# EasyEDA Pro project [Flatfish]_DevBoard.epro, board PCB
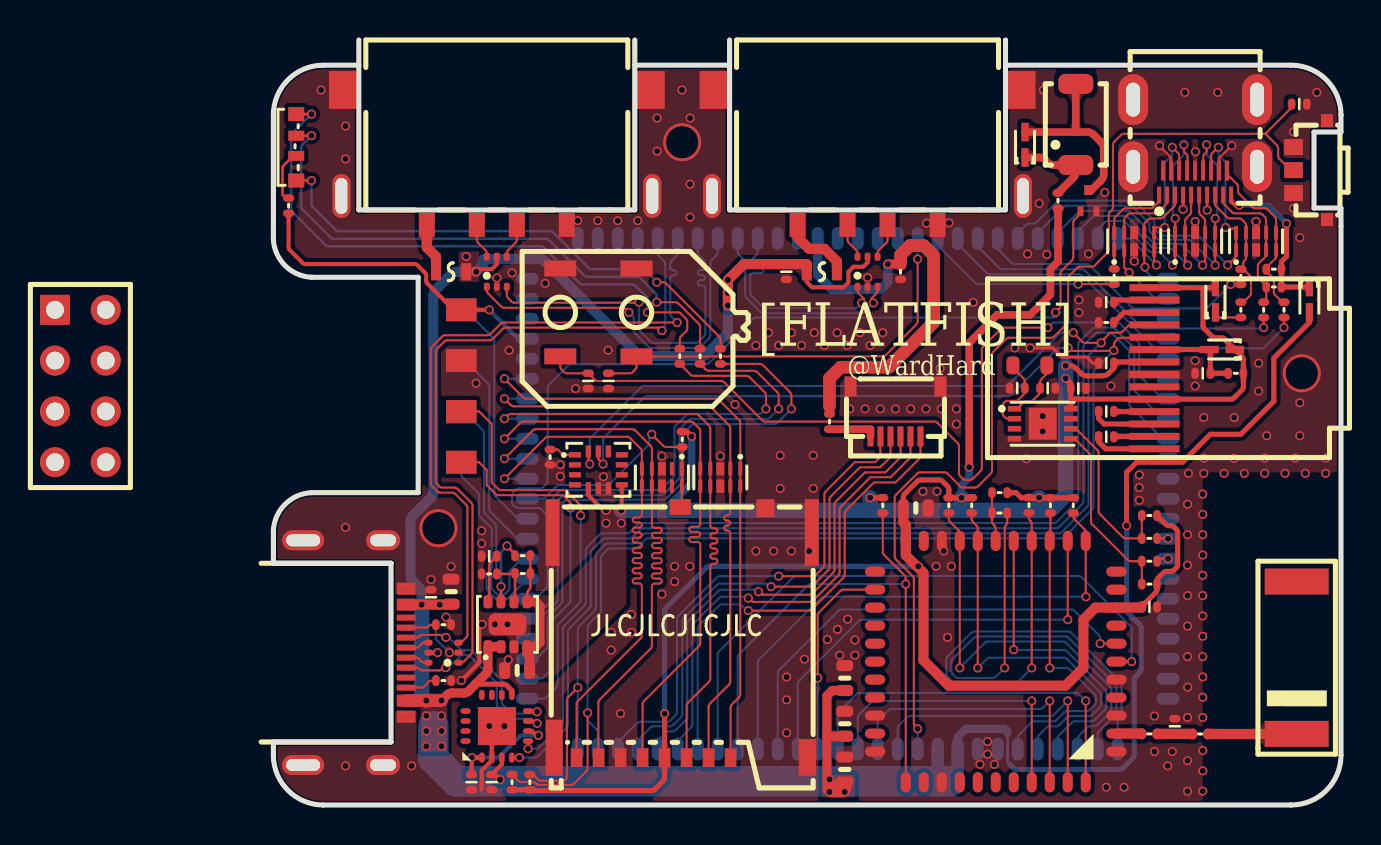
[diagram p1: board, top side]
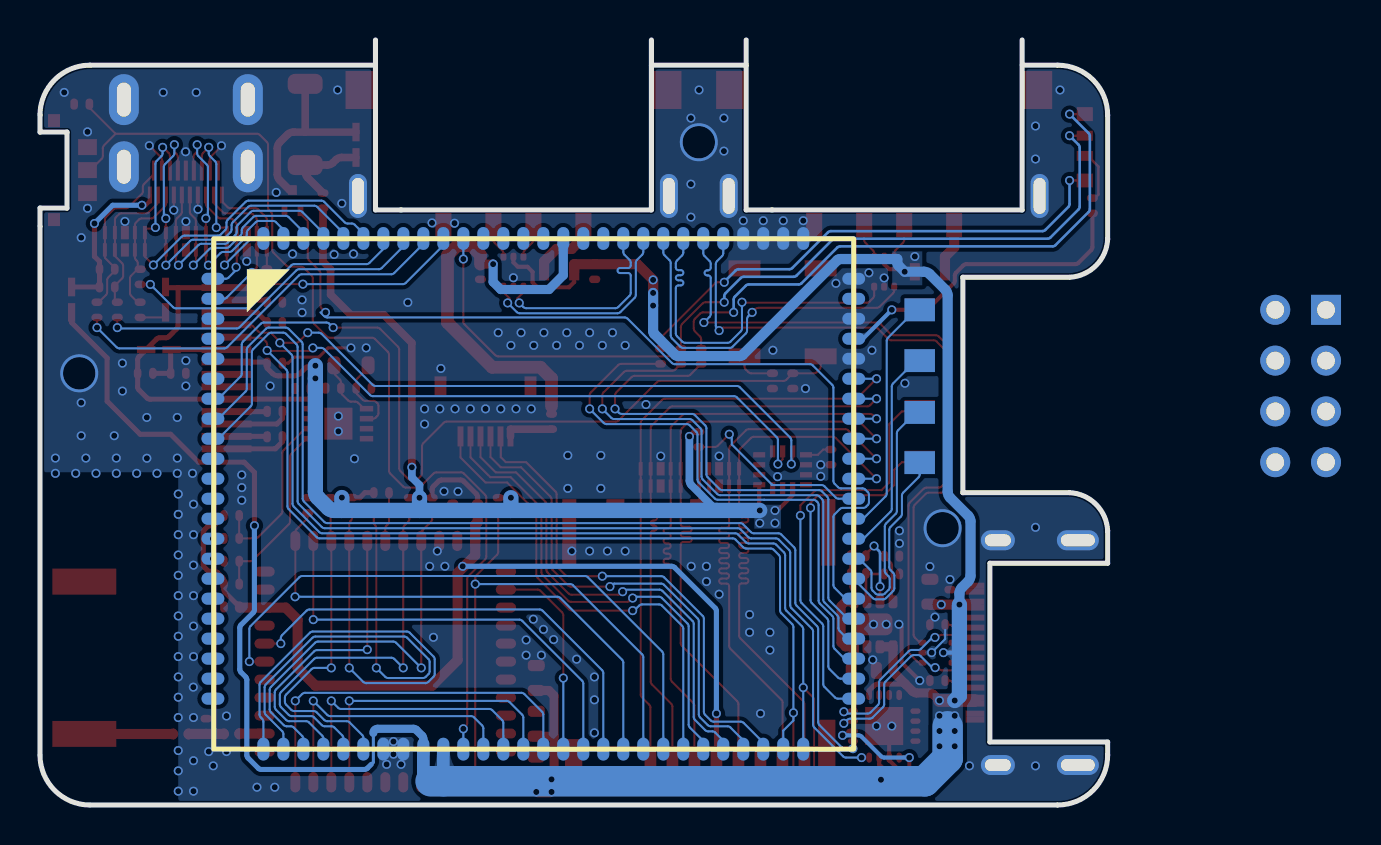
[diagram p2: board, bottom side, seen from below]

Outline 53.4 x 38.26 mm; copper layers: Top Layer, Bottom Layer. Coordinates in mm from the lower left corner of the outline.
Outline path: 4.27,37 2.5,37 arc(0.73,36.27) 0,34.5 0,28.3 arc(0.58,26.98) 1.91,26.39 7.24,26.39 7.24,15.62 1.91,15.62 arc(0.58,15.04) 0,13.72 0,12.09 5.89,12.09 5.89,3.15 0,3.15 0,2.5 arc(0.73,0.73) 2.5,0 50.9,0 arc(52.66,0.73) 53.4,2.5 53.4,28.94 ; 18.08,37 22.82,37 ; 36.62,37 50.9,37 arc(52.66,36.27) 53.4,34.5
Stack: Top Layer 0.035mm / Dielectric1 1.51mm FR4 er 4.5 / Bottom Layer 0.035mm

## Design rules (mm)
net USB0_DM: DP1
net USB0_DP: DP1
net USB1_DP: DP2
net USB1_DM: DP2
net USB2_DP: DP3
net USB2_DM: DP3
net UART0_DP: DP5
net UART0_DN: DP5
net USB3_DP: DP4
net USB3_DM: DP4
template: 自定义配置1
spacing copperThickness1oz (default): track to track 0.102, other pairs 0 to 0.3
spacing copperThickness2oz: track to track 0.203, other pairs 0.152 to 0.3
track width copperThickness1oz (default): min 0.102, default 0.102, max 2.54
track width copperThickness2oz: min 0.203, default 0.254, max 2.54
differential pair differentialPair (default): width min 0.102, default 0.203, max 2.54; gap min 0.152, default 0.152
via viaSize (default): diameter min 0.404, default 0.452, max 10; hole min 0.3, default 0.305, max 6.299

## Placement (name value [footprint] x y rotation side)
BUZZER2  DET402  [BUZ-SMD_L4.0-W3.0-LS4.5-FD]  40.13 34.04 90 top
C2  100nF  [C0603 NSK]  28.57 4.06 270 top
C33  10pF  [C0402-NSK]  38.73 20.85 180 top
C36  10pF  [C0402-NSK]  37.2 20.85 0 top
C43  22uF  [C0603 NSK]  12.19 6.73 0 top
C45  3.3nF  [C0402-NSK]  10.79 12.45 0 top
C46  1uF  [C0402-NSK]  41.66 18.42 180 top
C47  1uF  [C0402-NSK]  41.66 19.69 0 top
C48  2.2uF  [C0402-NSK]  41.66 25.15 180 top
C49  100nF  [C0402-NSK]  41.66 22.1 180 top
C76  22uF  [C0603 NSK]  8.89 10.67 270 top
C77  22uF  [C0603 NSK]  28.57 1.78 270 top
C78  100nF  [C0402-NSK]  7.89 10.39 90 top
C79  22uF  [C0603 NSK]  32.13 14.86 180 top
C80  100nF  [C0402-NSK]  43.81 9.91 0 top
C81  100nF  [C0402-NSK]  45.09 3.94 90 top
C83  22uF  [C0603 NSK]  28.57 6.35 270 top
C84  100nF  [C0402-NSK]  9.91 1.14 270 top
C85  100nF  [C0402-NSK]  10.92 1.14 270 top
C86  100nF  [C0402-NSK]  51.31 35.05 0 top
C87  100nF  [C0402-NSK]  15.75 21.21 270 top
C88  100nF  [C0402-NSK]  16.76 21.21 270 top
C89  100nF  [C0402-NSK]  40.26 20.83 180 top
C90  22uF  [C0402-NSK]  25.65 26.67 270 top
C91  2.2uF  [C0402-NSK]  46.48 21.59 0 top
CARD1  5033981892  [TF-SMD_503398-1892]  20.45 8.64 180 top
D3  ESD73034D  [DFN2510-10_L2.5-W1.0-P0.50-BL]  43.05 28.19 0 top
D4  ESD73034D  [DFN2510-10_L2.5-W1.0-P0.50-BL]  46.1 28.19 0 top
D5  USBLC6-2P6  [DFN2510-10_L2.5-W1.0-P0.50-BL]  49.15 28.19 0 top
D6  ESD73034D  [DFN2510-10_L2.5-W1.0-P0.50-BL]  22.35 16.38 180 top
D7  ESD73034D  [DFN2510-10_L2.5-W1.0-P0.50-BL]  19.43 16.38 180 top
D8  ESD73034D  [SOT-666-6_L1.6-W1.2-P0.50-LS1.6-BL]  29.72 26.67 0 top
D9  USBLC6-2P6  [SOT-666-6_L1.6-W1.2-P0.50-LS1.6-BL]  11.18 26.67 0 top
D10  USBLC6-2P6  [SOT-666-6_L1.6-W1.2-P0.50-LS1.6-BL]  8.51 7.62 90 top
F1  0603L035/16XR  [F0603]  27.43 26.67 0 top
F2  0603L035/16XR  [F0603]  8.89 26.67 180 top
H1  -  [圆形焊盘]  9.4 19.69 90 top
H2  B254YP-ZS04P  [圆形焊盘]  9.4 22.22 90 bottom
H3  -  [圆形焊盘]  9.4 24.77 90 bottom
H4  -  [圆形焊盘]  9.4 22.22 90 top
H5  -  [圆形焊盘]  9.4 24.77 90 top
H6  -  [圆形焊盘]  9.4 17.14 90 top
H7  -  [圆形焊盘]  9.4 17.12 270 bottom
H8  -  [圆形焊盘]  9.4 19.63 270 bottom
H9  圆形焊盘  [HDR-TH_8P-P2.54-V-F-R2-C5-S2.54_5-534206-4]  -9.65 20.95 270 top
LED1  XL-3806RGBC-4L  [LED-SMD_4P-L3.8-W1.0_XL-3806RGBC-4L]  1.14 32.89 270 top
OLED2  N050-8848TSWYG02-H14  [OLED-SMD_N050-8848TSWYG02-H14]  44.07 21.84 90 top
Q16  DTC143ZM  [SOT-723-3_L1.2-W0.8-P0.80-LS1.2-BR]  40.77 30.23 270 top
R1  100KΩ  [R0402]  20.45 18.29 90 top
R2  47KΩ  [R0402]  43.81 12.19 180 top
R3  150KΩ  [R0402]  43.81 13.33 180 top
R4  47KΩ  [R0402]  8.51 9.02 180 top
R5  47KΩ  [R0402]  8.51 6.22 0 top
R37  5.1kΩ  [R0402]  10.79 11.56 180 top
R38  0Ω  [R0402]  12.47 11.58 180 top
R39  0Ω  [R0402]  12.47 12.47 0 top
R54  20Ω  [R0402]  39.24 30.23 270 top
R55  1kΩ  [R0402]  42.05 26.43 270 top
R56  100Ω  [R0402]  49.53 24.77 270 top
R57  1.8kΩ  [R0402]  50.04 25.91 0 top
R58  100Ω  [R0402]  50.55 24.77 270 top
R59  1.8kΩ  [R0402]  50.04 26.8 0 top
R60  100Ω  [R0402]  48.39 26.42 270 top
R61  27kΩ  [R0402]  48.39 24.77 270 top
R62  5.1kΩ  [R0402]  43.81 11.05 180 top
R63  5.1kΩ  [R0402]  43.81 14.48 180 top
R64  0Ω  [R0402]  36.32 14.61 180 top
R65  0Ω  [R0402]  43.81 3.56 180 top
R66  0Ω  [R0402]  46.35 3.55 180 top
R67  560KΩ  [R0402]  41.66 24.13 0 top
R68  47KΩ  [R0402]  38.86 14.99 270 top
R69  47KΩ  [R0402]  37.79 15 270 top
R70  47KΩ  [R0402]  36.32 15.62 180 top
R71  47KΩ  [R0402]  34.93 14.99 270 top
R72  47KΩ  [R0402]  33.78 14.99 270 top
R73  10KΩ  [R0402]  40 14.99 270 top
R74  10KΩ  [R0402]  30.48 14.99 270 top
R75  0Ω  [R0402]  31.37 26.67 90 top
R76  2kΩ  [R0402]  0.76 29.97 270 top
R77  10kΩ  [R0402]  13.84 17.4 90 top
R78  5.1kΩ  [R0402]  12.83 1.14 90 top
R79  5.1kΩ  [R0402]  11.94 1.14 90 top
R80  0Ω  [R0402]  20.33 22.44 90 top
R81  0Ω  [R0402]  21.34 22.44 90 top
R82  0Ω  [R0402]  22.36 22.44 90 top
R83  0Ω  [R0402]  27.81 19.18 270 top
R84  2kΩ  [R0402]  48.13 21.59 0 top
SW1  EVPAEBB2A  [KEY-SMD_EVPAEBB2A]  51.86 31.75 90 top
SW2  SW_3*4*2MM  [SW-SMD_L3.9-W2.9-LS4.9-L]  14.35 24.64 270 top
SW3  SW_3*4*2MM  [SW-SMD_L3.9-W2.9-LS4.9-L]  18.16 24.64 270 top
U2  -  [AW869-A]  30.1 13.21 270 top
U3  OA-W01  [DS-H618-CORE]  12.45 28.58 0 bottom
U18  PCF85063  [VSON-8_L2.0-W3.0-P0.50-BL-EP]  38.47 19.07 270 top
U24  TPS82130SILR  [USIP-8_L3.0-W2.8-P0.65-TL-EP]  11.71 9.04 90 top
U32  1N5819WT  [SOD-523_L1.2-W0.8-LS1.6-RD]  37.59 33.02 90 top
U33  1N5819WT  [SOD-523_L1.2-W0.8-LS1.6-RD]  51.82 25.27 270 top
U34  1N5819WT  [SOD-523_L1.2-W0.8-LS1.6-RD]  47.12 25.27 90 top
U35  OA-W01  [ANT-SMD_L8.0-W3.0_A]  51.18 7.37 90 top
U37  -  [QFN-16_L3.0-W3.0-P0.50-TL-EP1.9]  11.18 3.94 90 top
U39  BMI270  [LGA-14_L3.0-W2.5-P0.50-BR]  16.26 16.76 180 top
U40  MTA-DT06-0050N-4/4/8/8  [FFC-SMD_6P-P0.50_FH34SRJ-6S-0.5SH]  31.12 19.69 180 top
U41  1N5819WT  [SOD-523_L1.2-W0.8-LS1.6-RD]  47.45 22.78 180 top
USB1  HX 8.5 CB1.9ZB  [MICRO-USB-SMD_HX-8.5-CB1.9ZB]  29.72 32.39 180 top
USB2  HX 8.5 CB1.9ZB  [MICRO-USB-SMD_HX-8.5-CB1.9ZB]  11.18 32.39 180 top
USB3  TYPE-C 16P CB1.6 073  [USB-C-SMD_SHOU_TYPE-C-16P-CB1.6]  4.06 7.62 270 top
USB5  HDMI-101S  [HDMI-SMD_HDMI-101S]  46.1 32.89 180 top
X1  32.768kHz  [OSC-SMD_L2.0-W1.2]  37.84 21.99 0 top

## Footprints (pads in the part's own frame, mm; a bottom-side part is the same pattern mirrored in y, then rotated)
ANT-SMD_L8.0-W3.0_A
  rect 1.3x3.2 smd: 1(-3.81,0) 2(3.81,0)
AW869-A
  oval 0.5x1.016 smd: 1(10.535,12.065) 2(9.635,12.065) 3(8.735,12.065) 4(7.835,12.065) 5(6.935,12.065) 6(6.035,12.065) 7(5.135,12.065) 8(4.235,12.065) 9(3.335,12.065) 10(2.435,12.065) 11(1.535,12.065) 23(1.535,-0.005) 24(2.435,-0.005) 25(3.335,-0.005) 26(4.235,-0.005) 27(5.135,-0.005) 28(6.035,-0.005) 29(6.935,-0.005) 30(7.835,-0.005) 31(8.735,-0.005) 32(9.635,-0.005) 33(10.535,-0.005)
  oval 1.016x0.5 smd: 12(0,10.53) 13(0,9.63) 14(0,8.73) 15(0,7.83) 16(0,6.93) 17(0,6.03) 18(0,5.13) 19(0,4.23) 20(0,3.33) 21(0,2.43) 22(0,1.53) 34(12.07,1.53) 35(12.07,2.43) 36(12.07,3.33) 37(12.07,4.23) 38(12.07,5.13) 39(12.07,6.03) 40(12.07,6.93) 41(12.07,7.83) 42(12.07,8.73) 43(12.07,9.63) 44(12.07,10.53)
BUZ-SMD_L4.0-W3.0-LS4.5-FD
  rrect 1x1.75 smd: 1(-2.03,0) 2(2.03,0)
C0402-NSK
  rrect 0.381x0.559 smd: 1(-0.381,0) 2(0.381,0)
C0603 NSK
  rrect 0.559x0.85 smd: 1(-0.623,0) 2(0.623,0)
DFN2510-10_L2.5-W1.0-P0.50-BL
  rect 0.2x0.665 smd: 1(-1,-0.433) 2(-0.5,-0.433) 4(0.5,-0.433) 5(1,-0.433) 6(1,0.433) 7(0.5,0.433) 9(-0.5,0.433) 10(-1,0.433)
  rect 0.4x0.665 smd: 3(0,-0.433) 8(0,0.433)
DS-H618-CORE
  oval 1.143x0.6 smd: 1(32.302,2.257) 2(32.302,3.257) 3(32.302,4.257) 4(32.302,5.257) 5(32.302,6.257) 6(32.302,7.257) 7(32.302,8.257) 8(32.302,9.257) 9(32.302,10.257) 10(32.302,11.257) 11(32.302,12.257) 12(32.302,13.257) 13(32.302,14.257) 14(32.302,15.257) 15(32.302,16.257) 16(32.302,17.257) 17(32.302,18.257) 18(32.302,19.257) 19(32.302,20.257) 20(32.302,21.257) 21(32.302,22.257) 22(32.302,23.257) 51(0.254,23.257) 52(0.254,22.257) 53(0.254,21.257) 54(0.254,20.257) 55(0.254,19.257) 56(0.254,18.257) 57(0.254,17.257) 58(0.254,16.257) 59(0.254,15.257) 60(0.254,14.257) 61(0.254,13.257) 62(0.254,12.257) 63(0.254,11.257) 64(0.254,10.257) 65(0.254,9.257) 66(0.254,8.257) 67(0.254,7.257) 68(0.254,6.257) 69(0.254,5.257) 70(0.254,4.257) 71(0.254,3.257) 72(0.254,2.257)
  oval 0.6x1.143 smd: 23(29.778,25.781) 24(28.778,25.781) 25(27.778,25.781) 26(26.778,25.781) 27(25.778,25.781) 28(24.778,25.781) 29(23.778,25.781) 30(22.778,25.781) 31(21.778,25.781) 32(20.778,25.781) 33(19.778,25.781) 34(18.778,25.781) 35(17.778,25.781) 36(16.778,25.781) 37(15.778,25.781) 38(14.778,25.781) 39(13.778,25.781) 40(12.778,25.781) 41(11.778,25.781) 42(10.778,25.781) 43(9.778,25.781) 44(8.778,25.781) 45(7.778,25.781) 46(6.778,25.781) 47(5.778,25.781) 48(4.778,25.781) 49(3.778,25.781) 50(2.778,25.781) 73(2.778,0.241) 74(3.778,0.241) 75(4.778,0.241) 76(5.778,0.241) 77(6.778,0.241) 78(7.778,0.241) 79(8.778,0.241) 80(9.778,0.241) 81(10.778,0.241) 82(11.778,0.241) 83(12.778,0.241) 84(13.778,0.241) 85(14.778,0.241) 86(15.778,0.241) 87(16.778,0.241) 88(17.778,0.241) 89(18.778,0.241) 90(19.778,0.241) 91(20.778,0.241) 92(21.778,0.241) 93(22.778,0.241) 94(23.778,0.241) 95(24.778,0.241) 96(25.778,0.241) 97(26.778,0.241) 98(27.778,0.241) 99(28.778,0.241) 100(29.778,0.241)
F0603
  rect 0.5x0.864 smd: 1(-0.753,0) 2(0.753,0)
FFC-SMD_6P-P0.50_FH34SRJ-6S-0.5SH
  rect 0.3x1 smd: 1(1.25,1.25) 2(0.75,1.25) 3(0.25,1.25) 4(-0.25,1.25) 5(-0.75,1.25) 6(-1.25,1.25)
  rect 0.6x1 smd: 7(-2.25,-1.25) 8(2.25,-1.25)
HDMI-SMD_HDMI-101S
  rect 0.2x0.84 smd: 1(1.8,2.385) 3(1.4,2.385) 5(1,2.385) 7(0.6,2.385) 9(0.2,2.385) 11(-0.2,2.385) 13(-0.6,2.385) 15(-1,2.385) 17(-1.4,2.385) 19(-1.8,2.385)
  rect 0.2x1 smd: 2(1.6,1.165) 4(1.2,1.165) 6(0.8,1.165) 8(0.4,1.165) 10(0,1.165) 12(-0.4,1.165) 14(-0.8,1.165) 16(-1.2,1.165) 18(-1.6,1.165)
  oval 1.5x2.55 hole 0.7x1.7: 20(-3.1,0.975) 20(-3.1,-2.385) 20(3.1,0.975) 20(3.1,-2.385)
HDR-TH_8P-P2.54-V-F-R2-C5-S2.54_5-534206-4
  rect 1.5x1.5 hole 0.89: 1(-3.81,-1.27)
  round 1.5 hole 0.89: 2(-3.81,1.27) 3(-1.27,-1.27) 4(-1.27,1.27) 5(1.27,-1.27) 6(1.27,1.27) 7(3.81,-1.27) 8(3.81,1.27)
KEY-SMD_EVPAEBB2A
  rect 0.8x0.94 smd: 1(-1.15,0.838) 2(0,0.838) 3(1.15,0.838)
  rect 0.65x0.6 smd: 4(2.475,-0.838) 5(-2.475,-0.838)
LED-SMD_4P-L3.8-W1.0_XL-3806RGBC-4L
  rect 0.7x0.8 smd: 1(1.66,0) 4(-1.66,0)
  rect 0.5x0.8 smd: 2(0.43,0) 3(-0.58,0)
LGA-14_L3.0-W2.5-P0.50-BR
  rect 0.6x0.27 smd: 1(1.17,-0.75) 2(1.17,-0.25) 3(1.17,0.25) 4(1.17,0.75) 8(-1.17,0.75) 9(-1.17,0.25) 10(-1.17,-0.25) 11(-1.17,-0.75)
  rect 0.27x0.6 smd: 5(0.5,0.92) 6(0,0.92) 7(-0.5,0.92) 12(-0.5,-0.92) 13(0,-0.92) 14(0.5,-0.92)
MICRO-USB-SMD_HX-8.5-CB1.9ZB
  rect 0.8x1.2 smd: 1(3.5,3.375) 2(1,3.375) 3(-1,3.375) 4(-3.5,3.375)
  oval 0.9x2.2 hole 0.6x1.8: 5(7.775,1.925) 6(-7.775,1.925)
  rect 1.5x1.9 smd: 7(7.65,-3.375) 8(-7.65,-3.375)
OLED-SMD_N050-8848TSWYG02-H14
  rect 0.35x2.5 smd: 1(-4.03,0) 2(-3.41,0) 3(-2.79,0) 4(-2.17,0) 5(-1.55,0) 6(-0.93,0) 7(-0.31,0) 8(0.31,0) 9(0.93,0) 10(1.55,0) 11(2.17,0) 12(2.79,0) 13(3.41,0) 14(4.03,0)
OSC-SMD_L2.0-W1.2
  rrect 0.65x0.9 smd: 1(-0.85,0) 2(0.85,0)
QFN-16_L3.0-W3.0-P0.50-TL-EP1.9
  oval 0.508x0.28 smd: 1(-1.565,0.749) 2(-1.565,0.249) 3(-1.565,-0.251) 4(-1.565,-0.751) 9(1.565,-0.751) 10(1.565,-0.251) 11(1.565,0.249) 12(1.565,0.749)
  oval 0.28x0.508 smd: 5(-0.739,-1.562) 6(-0.238,-1.562) 7(0.261,-1.562) 8(0.761,-1.562) 13(0.761,1.562) 14(0.261,1.562) 15(-0.238,1.562) 16(-0.739,1.562)
  rect 1.9x1.9 smd: 17(0.011,-0.001)
R0402
  rrect 0.381x0.559 smd: 1(-0.381,0) 2(0.381,0)
SOD-523_L1.2-W0.8-LS1.6-RD
  rect 0.93x0.36 smd: 1(-0.635,0) 2(0.635,0)
SOT-666-6_L1.6-W1.2-P0.50-LS1.6-BL
  rrect 0.3x0.4 smd: 1(-0.5,-0.75) 2(0,-0.75) 3(0.5,-0.75) 4(0.5,0.75) 5(0,0.75) 6(-0.5,0.75)
SOT-723-3_L1.2-W0.8-P0.80-LS1.2-BR
  rect 0.489x0.294 smd: 1(0.529,-0.4) 2(0.529,0.4)
  rect 0.489x0.434 smd: 3(-0.529,0)
SW-SMD_L3.9-W2.9-LS4.9-L
  rect 0.8x1.6 smd: 1(-2.2,0) 2(2.2,0)
TF-SMD_503398-1892
  rect 0.584x0.94 smd: 1(-2.42,6.27) 2(-1.32,6.27) 3(-0.22,6.27) 4(0.88,6.27) 5(1.98,6.27) 6(3.08,6.27) 7(4.18,6.27) 8(5.28,6.27)
  rect 1.05x0.78 smd: 9(0.095,-6.27)
  rect 0.9x0.9 smd: 10(-4.17,-6.21)
  rect 0.7x3.33 smd: 11(-6.48,-4.995) 11(6.48,-4.995)
  rect 0.861x1.83 smd: 11(-6.26,6.255)
  rect 0.86x2.8 smd: 11(6.4,5.77)
USB-C-SMD_SHOU_TYPE-C-16P-CB1.6
  oval 1x1.7 hole 0.6x1.3: 25(5.62,1.425) 28(-5.62,1.425)
  oval 1x2.1 hole 0.6x1.7: 26(5.62,-2.575) 27(-5.62,-2.575)
  rect 0.3x0.94 smd: A1(-3.35,2.575) A4(-2.55,2.575) A5(-1.25,2.575) A6(-0.25,2.575) A7(0.25,2.575) A8(1.25,2.575) A9(2.55,2.575) A12(3.35,2.575) B1(3.05,2.575) B4(2.25,2.575) B5(1.75,2.575) B6(0.75,2.575) B7(-0.75,2.575) B8(-1.75,2.575) B9(-2.25,2.575) B12(-3.05,2.575)
USIP-8_L3.0-W2.8-P0.65-TL-EP
  rrect 0.65x0.45 smd: 1(-1.125,0.975) 2(-1.125,0.325) 3(-1.125,-0.325) 4(-1.125,-0.975) 5(1.125,-0.975) 6(1.125,-0.325) 7(1.125,0.325) 8(1.125,0.975)
  rrect 1.1x1.9 smd: 9(0,0)
VSON-8_L2.0-W3.0-P0.50-BL-EP
  rect 0.28x0.665 smd: 1(-0.75,-1.407) 2(-0.25,-1.407) 3(0.25,-1.407) 4(0.75,-1.407) 5(0.75,1.407) 6(0.25,1.407) 7(-0.25,1.407) 8(-0.75,1.407)
  rect 1.6x1.4 smd: 9(0,0)
圆形焊盘
  rect 1.143x1.524 smd: 1(0,0)

## Nets
AGND: R75.2 R83.1 U3.85
GND: C2.1 C33.1 C36.1 C43.1 C45.1 C48.2 C49.2 C76.1 C77.1 C78.2 C79.1 C80.2 C81.2 C83.1 C84.2 C85.2 C86.2 C87.2 C88.2 C89.1 C90.2 C91.1 CARD1.6 CARD1.10 CARD1.11 D3.3 D3.8 D4.3 D4.8 D5.3 D5.8 D6.3 D6.8 D7.3 D7.8 D8.2 D9.2 D10.2 H4.1 OLED2.7 Q16.2 R4.1 R5.2 R37.2 R67.1 R75.1 R77.1 SW1.1 SW1.3 SW1.4 SW1.5 SW2.1 SW3.1 U2.1 U2.3 U2.5 U2.20 U2.31 U2.33 U2.36 U3.29 U3.30 U3.68 U3.70 U3.72 U3.73 U3.74 U3.75 U3.76 U18.4 U18.9 U24.3 U24.9 U37.2 U37.17 U39.6 U39.7 U40.7 U40.8 USB1.4 USB1.5 USB1.6 USB1.7 USB1.8 USB2.4 USB2.5 USB2.6 USB2.7 USB2.8 USB3.25 USB3.26 USB3.27 USB3.28 USB3.A1 USB3.A12 USB3.B1 USB3.B12 USB5.4 USB5.7 USB5.10 USB5.13 USB5.16 USB5.20
VBUS: C2.2 C76.2 C77.2 C78.1 C83.2 C85.1 C90.1 D8.5 D9.5 D10.5 F1.1 F2.1 U3.31 U3.32 U24.1 U24.2 U33.2 U37.3 U37.9 USB3.A4 USB3.A9 USB3.B4 USB3.B9
VDD_3V3: C43.2 C49.1 C79.2 C80.1 C89.2 CARD1.4 OLED2.5 OLED2.8 OLED2.14 R1.2 R38.1 R39.2 R54.2 R62.1 R63.1 R68.1 R69.1 R70.1 R71.1 R72.1 R73.1 R74.1 R78.1 R79.1 R84.2 U2.9 U2.22 U18.8 U24.4 U24.5 U34.2 U39.5 U39.8 U41.1
VDDCH_3V: C84.1 U37.1 U37.6
$BUZZER2_1: BUZZER2.1 R54.1 U32.1
$BUZZER2_2: BUZZER2.2 Q16.3 U32.2
$C33_2: C33.2 U18.1 X1.2
$C36_2: C36.2 U18.2 X1.1
$C45_2: C45.2 U24.8
$C46_1: C46.1 OLED2.2
$C46_2: C46.2 OLED2.1
$C47_1: C47.1 OLED2.3
$C47_2: C47.2 OLED2.4
$C48_1: C48.1 OLED2.13
$C81_1: C81.1 R65.1 R66.2
$F1_2: F1.2 USB1.1
$F2_2: F2.2 USB2.1
$LED1_1: LED1.1 R82.2
$LED1_2: LED1.2 R76.1
$LED1_3: LED1.3 R81.2
$LED1_4: LED1.4 R80.2
$OLED2_12: OLED2.12 R67.2
$R2_1: R2.1 U3.15
$R3_1: R3.1 U3.14
$R4_2: R4.2 USB3.A5
$R5_1: R5.1 USB3.B5
$R39_1: R39.1 U24.7
$R61_2: R61.2 U34.1
$R64_1: R64.1 U3.24
$R65_2: R65.2 U2.2
$R66_1: R66.1 U35.1
$R77_2: R77.2 U39.1
$R83_2: R83.2 U40.1
AP_32K_OUT: U2.24 U3.38
AP_WAKE_BT: U2.6 U3.43
BT_REG_ON: R74.2 U2.34 U3.42
BT_UART_CTS: U2.41 U3.36
BT_UART_RTS: U2.44 U3.37
BT_UART_RX: U2.42 U3.35
BT_UART_TX: U2.43 U3.34
BT_WAKE_AP: U2.7 U3.40
FB: R37.1 R38.2 U24.6
FEL: C87.1 SW2.2 U3.7
HD_CEC: D5.2 D5.9 R60.1 R61.1 USB5.15
HD_CK+: D4.5 D4.6 U3.96 USB5.12
HD_CK-: D5.1 D5.10 U3.95 USB5.14
HD_D0+: D4.2 D4.9 U3.98 USB5.9
HD_D0-: D4.4 D4.7 U3.97 USB5.11
HD_D1+: D3.5 D3.6 U3.100 USB5.6
HD_D1-: D4.1 D4.10 U3.99 USB5.8
HD_D2+: D3.2 D3.9 U3.2 USB5.3
HD_D2-: D3.4 D3.7 U3.1 USB5.5
HD_HPD: D3.1 D3.10 R55.1 USB5.1
HD_SCL: D5.4 D5.7 R56.1 R57.1 USB5.17
HD_SDA: D5.5 D5.6 R58.1 R59.1 USB5.18
HDMI_5V: R57.2 R59.2 U33.1 USB5.19
HDMI_CEC: R60.2 U3.94
HDMI_HPD: R55.2 U3.91
HDMI_SCL: R56.2 U3.93
HDMI_SDA: R58.2 U3.92
I2S_BCK: U3.45 U40.5
I2S_DI: U3.47 U40.3
I2S_DO: U3.48 U40.2
I2S_LRCK: U3.46 U40.4
I2S_MCK: U3.44 U40.6
LED_B: R82.1 U3.53
LED_G: R81.1 U3.54
LED_R: R80.1 U3.55
OLED_RST: C91.2 OLED2.9 R84.1 U41.2
OLED_SCL: OLED2.10 R79.2 U3.49 U39.13
OLED_SDA: OLED2.11 R78.2 U3.50 U39.14
PI13: H7.1 U3.57
PI14: H8.1 U3.58
PI15: H2.1 U3.59
PI16: H3.1 U3.60
POWER_ON: C86.1 SW1.2 U3.33
RESET: C88.1 SW3.2 U3.90
RTC_SCK: R3.2 R63.2 U18.6
RTC_SDA: R2.2 R62.2 U18.5
SD_CLK: CARD1.5 D6.5 D6.6 U3.64
SD_CMD: CARD1.3 D6.4 D6.7 U3.65
SD_D0: CARD1.7 D7.4 D7.7 U3.63
SD_D1: CARD1.8 D7.5 D7.6 U3.62
SD_D2: CARD1.1 D6.1 D6.10 U3.67
SD_D3: CARD1.2 D6.2 D6.9 U3.66
SD_DET: CARD1.9 D7.1 D7.10 R1.1 U3.61
SPKOUT: Q16.1 U3.56
TWI1_SCK: H1.1 U3.51
TWI1_SDA: H6.1 U3.52
U0_DM: D10.6 USB3.A7
U0_DP: D10.4 USB3.A6
U1_DM: D9.6 USB2.2
U1_DP: D9.4 USB2.3
U2_DM: D8.6 USB1.2
U2_DP: D8.4 USB1.3
UART0_DN: U37.8 USB3.B7
UART0_DP: U37.7 USB3.B6
UART0_RXD: U3.9 U37.4
UART0_TXD: U3.8 U37.5
USB0_DM: D10.1 U3.77
USB0_DP: D10.3 U3.78
USB1_DM: D9.1 U3.80
USB1_DP: D9.3 U3.79
USB2_DM: D8.1 U3.82
USB2_DP: D8.3 U3.81
USB3_DM: U3.83
USB3_DP: U3.84
VOUT_1V8: U3.71
VOUT_3V3: H5.1 R76.2 U3.69
WL_CLK: R64.2 R70.2 U2.17
WL_CMD: U2.16 U3.26
WL_D0: R71.2 U2.18 U3.27
WL_D1: R72.2 U2.19 U3.25
WL_D2: R68.2 U2.14 U3.28
WL_D3: R69.2 U2.15 U3.23
WL_REG_ON: R73.2 U2.12 U3.41
WL_WAKE_AP: U2.13 U3.39

Pads without a net: D7 2 9; H9 1 2 3 4 5 6 7 8; OLED2 6; U2 4 8 10 11 21 23 25 26 27 28 29 30 32 35 37 38 39 40; U3 3 4 5 6 10 11 12 13 16 17 18 19 20 21 22 86 87 88 89; U18 3 7; U35 2; U37 10 11 12 13 14 15 16; U39 2 3 4 9 10 11 12; USB3 A8 B8; USB5 2

## Via types
v1: diameter 0.452, hole 0.305, Top Layer to Bottom Layer, 316 vias
v2: diameter 1.9, hole 1.62, Top Layer to Bottom Layer, 3 vias

## Routing (per net, layer and track width the routed paths; a pad name or vN(x,y) marks a point on that pad's centre or on a via; arc(x,y) is an arc through that point)
AGND: length 21.3
  Top Layer w0.381: R83.1 27.81,19.94
  Top Layer w0.457: v1(30.73,27.05) R75.2
  Top Layer w0.635: R75.2 31.37,27.51 31.84,27.98 32.53,27.98 33.02,27.48 33.02,24.13 30.78,21.89 28.37,21.89 27.81,21.34 27.81,19.94
  Bottom Layer w0.457: U3.85 27.22,26.5 27.94,25.78 30.35,25.78 30.73,26.16 v1(30.73,27.05)
GND: length 16.5
  Top Layer w0.102: USB5.7 45.5,29.8 v1(45.5,29.79) ; USB5.16 47.3,32.27 arc(47.32,32.35) 47.36,32.42 47.88,32.94 arc(47.92,33) 47.94,33.08 ; USB5.4 44.9,32.29 arc(44.89,32.37) 44.84,32.44 44.38,32.9 arc(44.34,32.96) 44.32,33.04 ; USB5.13 46.7,29.76 v1(46.71,29.75)
  Top Layer w0.152: C49.2 40.98,22.1 40.68,22.4 39.45,22.4 38.99,22.86 v1(37.85,22.86)
  Top Layer w0.203: 10.42,0.76 10.42,1.73 10.93,2.24 U37.2 10.93,3.7 U37.17 ; v1(10.44,9.04) 10.3,8.9 10.3,7.13 v1(9.4,6.22)
  Bottom Layer w0.102: v1(8.8,7.62) 8.13,8.3 8.13,8.76
  vias: v1(2.38,35.76) v1(3.61,33.96) v1(3.61,32.31) v1(3.61,13.89) v1(3.61,1.96) v1(6.91,1.96) v1(7.89,11.28) v1(8.64,9.4) v1(8.89,11.93) v1(10.14,21.09) v1(10.41,13.72) v1(10.41,13.08) v1(10.8,3.95) v1(11.07,9.04) v1(11.18,26.36) v1(11.56,3.95) v1(11.71,9.04) v1(11.75,7.26) v1(11.79,22.74) v1(11.94,26.62) v1(13.59,26.09) v1(14.35,17.02) v1(14.35,16.44) v1(15.11,20.83) v1(15.22,29.22) v1(16.22,29.22) v1(16.51,16.42) v1(16.74,22.74) v1(16.89,8.64) v1(16.89,7.75) v1(17.22,29.22) v1(17.36,4.58) v1(17.91,9.53) v1(17.91,8.64) v1(18.22,29.22) v1(19.19,34.35) v1(19.19,32.7) v1(19.43,17.45) v1(19.43,10.54) v1(20.07,11.94) v1(20.07,11.18) v1(20.44,35.76) v1(20.84,34.35) v1(20.84,31.05) v1(20.84,29.4) v1(20.83,11.94) v1(22.35,17.45) v1(23.09,20.03) v1(24.13,22.99) v1(24.13,12.7) v1(24.76,23.62) v1(25.02,12.7) v1(25.27,22.99) v1(25.35,17.49) v1(25.35,15.83) v1(25.67,6.4) v1(25.67,5.26) v1(25.67,3.61) v1(25.91,23.62) v1(25.91,12.7) v1(26.42,22.99) v1(26.56,7.29) v1(26.8,12.7) v1(27,17.49) v1(27,15.83) v1(27.05,23.62) v1(27.56,22.99) v1(27.71,8.28) v1(28.19,23.62) v1(28.22,8.78) v1(28.32,7.49) v1(28.7,22.99) v1(28.72,9.29) v1(28.83,19.81) v1(29.08,8.25) v1(29.08,7.49) v1(29.34,23.62) v1(29.59,19.81) v1(29.72,26.37) v1(29.84,22.99) v1(30.35,19.81) v1(30.48,23.62) v1(31.12,19.81) v1(31.88,19.81) v1(32.49,15.68) v1(32.64,19.81) v1(32.66,29.1) v1(33.15,11.94) v1(33.19,15.69) v1(33.35,21.83) v1(33.4,19.81) v1(33.53,12.7) v1(33.72,8.39) v1(33.79,29.11) v1(33.91,11.94) v1(34.16,19.81) v1(34.16,19.05) v1(35,25.13) v1(35.34,2.03) v1(35.72,3.17) v1(35.72,2.54) v1(36.06,2.03) v1(37.08,22.86) v1(37.72,27.56) v1(37.67,17.32) v1(38.3,30.09) v1(38.51,35.76) v1(38.47,19.45) v1(38.47,18.69) v1(38.69,27.53) v1(40.29,25.26) v1(40.29,24.63) v1(40.77,27.56) v1(41.58,30.64) v1(41.66,0.89) v1(41.89,20.95) v1(42.54,0.89) v1(43.06,27.19) v1(43.31,16.51) v1(43.31,15.88) v1(43.31,15.24) v1(44.07,4.45) v1(44.07,2.67) v1(44.32,32.97) v1(44.73,1.96) v1(44.96,2.67) v1(45.58,35.64) v1(45.72,15.04) v1(45.72,13.52) v1(45.72,12) v1(45.72,10.47) v1(45.72,8.95) v1(45.72,7.42) v1(45.73,5.89) v1(45.72,4.38) v1(45.72,2.22) v1(45.72,0.69) v1(45.77,16.59) v1(46.12,32.67) v1(46.1,29.19) v1(46.1,22.22) v1(46.1,20.95) v1(46.53,19.38) v1(46.53,17.35) v1(46.53,16.59) v1(46.48,15.55) v1(46.48,14.53) v1(46.48,13.52) v1(46.48,12.5) v1(46.48,11.49) v1(46.48,10.47) v1(46.48,9.45) v1(46.48,8.44) v1(46.48,7.42) v1(46.48,6.41) v1(46.48,5.39) v1(46.48,4.38) v1(46.48,2.72) v1(46.48,1.71) v1(46.48,0.69) v1(47.23,35.64) v1(47.55,16.59) v1(47.93,32.98) v1(48.06,19.38) v1(48.05,17.34) v1(48.56,16.59) v1(49.15,29.19) v1(49.28,22.1) v1(49.28,20.7) v1(49.58,17.35) v1(49.58,16.59) v1(49.69,18.47) v1(50.6,16.59) v1(51.02,33.67) v1(51.02,29.84) v1(51.1,17.35) v1(51.34,28.37) v1(51.34,20.12) v1(51.34,18.47) v1(51.61,16.59) v1(52.19,35.64) v1(52.63,17.35) v1(52.63,16.59) v2(8.25,13.84) v2(20.45,33.15) v2(51.44,21.59)
VBUS: length 145.9
  Top Layer w0.203: D9.5 11.18,27.05 10.92,26.8 10.03,26.8 ; v1(8.21,7.62) 7.76,7.62 ; v1(11.34,1.27) 11.08,1.52 C85.1 11.43,2.03 U37.3 ; D8.5 29.72,27.14 29.5,26.92 29.02,26.92 28.76,26.66 28.76,26.14 28.52,25.89 26.94,25.89 26.68,26.15 F1.1
  Top Layer w0.254: v1(42.67,13.97) 42.67,16.64 43.18,17.14 45.47,17.14 46.86,18.54 48.39,18.54 50.04,20.19 50.04,22.35 51.82,24.13 U33.2 ; U37.9 11.93,5.73 11.7,5.96 arc(11.6,6.02) 11.48,6.05 10.11,6.05
  Top Layer w0.457: 27.69,3.44 27.69,5.46 27.95,5.73 28.57,5.73 ; 27.69,3.44 C2.2 ; 27.69,3.44 27.69,0.83 ; U24.2 U24.1 10.73,6.8 arc(10.71,6.68) 10.64,6.58 10.11,6.05 10.11,6.05 9.76,5.69 arc(9.66,5.63) 9.55,5.6 8.91,5.6 arc(8.8,5.58) 8.7,5.51 v1(8.41,5.22)
  Top Layer w0.508: C76.2 8.87,10.02 v1(8.32,10.02) v1(7.41,10.02) 6.57,10.02 ; v1(22.73,24.98) v1(22.73,25.61) v1(22.73,26.26) 23.52,27.05 C90.1 26.68,27.05 F1.1
  Top Layer w0.635: 6.64,5.22 v1(7.65,5.22) v1(8.41,5.22)
  Top Layer w0.889: 28.46,0.83 27.94,0.83
  Bottom Layer w0.152: 36.83,2.03 36.72,2.14 36.72,3.61
  Bottom Layer w0.203: 7.41,7.66 7.45,7.62 v1(8.21,7.62)
  Bottom Layer w0.254: v1(42.67,13.97) 42.67,9.76 arc(42.69,9.69) 42.73,9.62 43.35,9.01 arc(43.39,8.94) 43.41,8.86 43.41,6.79 arc(43.39,6.71) 43.35,6.64 43.11,6.41 arc(43.07,6.34) 43.05,6.27 43.05,2.5 arc(43.04,2.42) 42.99,2.35 42.48,1.84 arc(42.41,1.79) 42.33,1.78 37.17,1.78 arc(37.09,1.79) 37.02,1.84 36.83,2.03
  Bottom Layer w0.406: U3.31 34.22,3.32 arc(34.24,3.4) 34.28,3.46 34.57,3.75 arc(34.64,3.79) 34.71,3.81 36.52,3.81 arc(36.66,3.75) 36.72,3.61
  Bottom Layer w0.508: v1(22.73,25.61) v1(22.73,24.98) 22.73,23.71 arc(22.72,23.63) 22.67,23.56 21.62,22.51 arc(21.56,22.47) 21.48,22.45 18.4,22.45 arc(18.32,22.47) 18.25,22.51 13.52,27.25 arc(13.46,27.29) 13.38,27.31 10.52,27.31 10.52,27.12 arc(10.5,27.04) 10.46,26.98 v1(10.15,26.67) 9.19,26.67 arc(9.03,26.64) 8.9,26.55 8.12,25.77 arc(8.03,25.64) 8,25.49 8,15.66 arc(7.97,15.51) 7.88,15.38 6.98,14.47 arc(6.89,14.34) 6.86,14.18 6.86,11.47 arc(6.89,11.32) 6.98,11.18 7.29,10.87 arc(7.38,10.74) 7.41,10.58 v1(7.41,10.02)
  Bottom Layer w0.635: 33.22,1.16 U3.32 ; 34.22,1.08 U3.31
  Bottom Layer w0.762: v1(7.65,5.22) 7.41,5.46 v1(7.41,10.02)
  Bottom Layer w1.524: 33.86,1.19 9.14,1.19 8,2.33 8,3.94
  vias: v1(7.65,4.46) v1(7.65,3.7) v1(7.65,2.94) v1(8.41,4.46) v1(8.41,3.7) v1(8.41,2.94) v1(9.64,27.43) v1(27.81,1.28) v1(27.81,0.65) v1(28.57,0.65)
VDD_3V3: length 155.5
  Top Layer w0.127: R39.2 R38.1 12.85,10.9 arc(12.84,10.83) 12.79,10.76 12.76,10.73 arc(12.72,10.66) 12.7,10.58 12.7,10.18 U24.5
  Top Layer w0.203: 16.51,14.73 15.76,15.49 U39.5 ; U39.8 17.43,14.76 v1(17.4,14.73)
  Top Layer w0.254: 38.33,15.37 R68.1 R73.1 ; 38.33,15.37 37.4,15.37 37.15,15.62 R70.1 ; 38.33,15.37 R69.1 ; R1.2 20.68,18.67 v1(20.92,18.43) ; 46.49,25.87 OLED2.14 ; 46.49,25.87 47.08,25.87 U34.2 ; 46.49,25.87 46.49,23.97 arc(46.51,23.89) 46.55,23.82 46.95,23.43 arc(47.02,23.38) 47.09,23.37 47.41,23.37 arc(47.49,23.35) 47.56,23.31 U41.1 48.45,22.41 arc(48.5,22.35) 48.51,22.27 R84.2 48.51,20.91 arc(48.5,20.83) 48.45,20.77 48.04,20.35 arc(47.97,20.31) 47.9,20.29 OLED2.5 42.56,20.29 42.56,20.3 39.88,20.3 ; v1(19.57,4.57) CARD1.4 19.57,1.36 arc(19.55,1.29) 19.51,1.22 19.07,0.79 arc(19.01,0.74) 18.93,0.73 13.1,0.73 13.07,0.76 R79.1 ; v1(29.84,15.37) R74.1 ; v1(39.62,21.97) 39.84,21.97 arc(39.99,21.94) 40.12,21.85 40.39,21.58 arc(40.53,21.49) 40.68,21.46 41.49,21.46 arc(41.64,21.49) 41.77,21.58 42.04,21.85 C49.1 42.09,22.15 OLED2.8 ; 43.45,9.95 44.14,10.63 arc(44.18,10.7) 44.2,10.77 R62.1 44.2,11.22 arc(44.21,11.3) 44.26,11.36 44.52,11.62 arc(44.58,11.67) 44.66,11.68 44.89,11.68 arc(44.97,11.7) 45.03,11.74 45.17,11.88 arc(45.21,11.94) 45.23,12.02 45.23,13.63 arc(45.21,13.71) 45.17,13.78 45.03,13.91 arc(44.97,13.95) 44.89,13.97 44.79,13.97 arc(44.71,13.99) 44.64,14.03 R63.1 ; 39.88,20.3 39.88,21.08 v1(39.62,21.34) ; 39.88,20.3 U18.8 ; C79.2 31.51,15.41 arc(31.52,15.49) 31.57,15.55 32.21,16.2 arc(32.28,16.24) 32.36,16.26 33.32,16.26 arc(33.39,16.24) 33.46,16.2 33.72,15.93 arc(33.77,15.87) 33.78,15.79 R72.1 v1(34.42,15.37) R71.1
  Top Layer w0.381: R54.2 39.24,27.18 38.86,26.8 38.86,25.53 37.85,24.51 36.19,24.51 34.8,23.11 v1(34.8,16.89)
  Top Layer w0.457: U24.5 13.12,10.16 13.34,9.95 13.34,8.13 13.12,7.91 U24.4 12.68,7.58 12.81,7.45 C43.2
  Top Layer w0.508: C79.2 31.51,14.14 31.63,14.02 U2.22 31.63,12.49 32.51,11.61 32.51,7.24 33.78,5.97 39.62,5.97 40.51,6.86 40.51,9.27 41.12,9.87 U2.9 43.4,9.87
  Bottom Layer w0.254: v1(19.57,4.57) 19.57,9.7 arc(19.58,9.78) 19.63,9.85 21.66,11.88 arc(21.72,11.92) 21.8,11.94 v1(32.26,11.94)
  Bottom Layer w0.381: v1(20.92,18.43) 20.92,16.22 arc(20.89,16.1) 20.83,16 19.56,14.73 ; v1(34.8,16.89) 34.8,16.38 34.42,16 v1(34.42,15.37)
  Bottom Layer w0.762: v1(34.42,15.37) 34.42,14.73 ; 34.42,14.73 29.84,14.73 ; 34.42,14.73 38.3,14.73 ; v1(39.62,21.97) v1(39.62,21.34) 39.62,15.66 arc(39.59,15.51) 39.5,15.38 38.98,14.85 arc(38.85,14.76) 38.69,14.73 38.3,14.73 ; v1(29.84,15.37) 29.84,14.73 ; 29.84,14.73 v1(17.4,14.73) ; 38.3,14.73 v1(38.3,15.38)
  vias: v1(16.64,14.73) v1(16.64,14.1) v1(17.4,14.1)
VDDCH_3V: length 5.8
  Top Layer w0.203: 10.03,2.37 v1(9.92,2.37) 9.92,1.54 C84.1 ; v1(13.26,3.48) 13.21,3.43 12.94,3.7 U37.6
  Top Layer w0.254: 10.03,2.37 U37.1
  Bottom Layer w0.203: v1(9.92,2.37) 11.18,2.37 arc(11.26,2.39) 11.32,2.43 12.31,3.42 arc(12.38,3.47) 12.46,3.48 v1(13.26,3.48)
$BUZZER2_1: length 4.4
  Top Layer w0.381: U32.1 38.31,32.39 arc(38.47,32.35) 38.6,32.27 38.74,32.12 arc(38.87,32.04) 39.03,32.01 BUZZER2.1 40.13,31.66 arc(40.1,31.51) 40.01,31.38 R54.1
$BUZZER2_2: length 9.2
  Top Layer w0.381: U32.2 40.13,33.66 ; 40.13,33.66 40.73,33.66 arc(40.88,33.62) 41.01,33.54 41.41,33.14 arc(41.5,33.01) 41.53,32.85 41.53,31.54 arc(41.5,31.38) 41.41,31.25 40.92,30.76 Q16.3 ; 40.13,33.66 BUZZER2.2
$C33_2: length 3.1
  Top Layer w0.102: U18.1 37.19,19.82 37.49,20.11 arc(37.55,20.16) 37.63,20.17 37.84,20.17 arc(37.92,20.19) 37.99,20.23 38.29,20.53 arc(38.33,20.6) 38.35,20.68 C33.2 38.35,21.14 arc(38.36,21.22) 38.41,21.29 38.63,21.51 arc(38.67,21.58) 38.69,21.65 X1.2
$C36_2: length 4.1
  Top Layer w0.102: X1.1 36.99,21.86 37.53,21.33 arc(37.57,21.26) 37.58,21.19 C36.2 37.58,20.68 arc(37.57,20.6) 37.53,20.53 37.26,20.27 arc(37.2,20.23) 37.12,20.21 36.72,20.21 arc(36.65,20.2) 36.58,20.15 36.53,20.1 arc(36.48,20.04) 36.47,19.96 36.47,19.6 arc(36.48,19.52) 36.53,19.45 36.6,19.38 arc(36.67,19.33) 36.75,19.32 U18.2
$C45_2: length 2.5
  Top Layer w0.127: U24.8 10.79,10.22 10.79,11.98 arc(10.81,12.06) 10.85,12.12 C45.2
$C46_1: length 2
  Top Layer w0.254: C46.1 42.06,18.43 OLED2.2
$C46_2: length 3.2
  Top Layer w0.254: OLED2.1 41.62,17.81 41.28,18.16 C46.2
$C47_1: length 3.3
  Top Layer w0.254: C47.1 41.28,19.33 41.55,19.05 OLED2.3
$C47_2: length 2
  Top Layer w0.254: OLED2.4 42.05,19.67 C47.2
$C48_1: length 2.1
  Top Layer w0.254: OLED2.13 42.15,25.25 C48.1
$C81_1: length 1.8
  Top Layer w0.508: R66.2 45.97,3.56 C81.1 R65.1
$F1_2: length 3.6
  Top Layer w0.508: USB1.1 26.22,28.39 26.8,27.81 27.56,27.81 28.19,27.19 F1.2
$F2_2: length 2.4
  Top Layer w0.508: F2.2 8.14,27.42 7.68,27.88 7.68,28.88
$LED1_1: length 25.7
  Top Layer w0.102: R82.2 22.36,23.28 arc(22.34,23.35) 22.3,23.42 19.64,26.08 arc(19.57,26.13) 19.49,26.14 v1(19.17,26.14)
  Top Layer w0.127: v1(1.91,31.23) LED1.1
  Bottom Layer w0.127: 19.18,26.16 18.6,26.74 arc(18.54,26.78) 18.46,26.8 15.92,26.8 arc(15.84,26.81) 15.77,26.86 13.99,28.64 arc(13.92,28.69) 13.84,28.7 3.26,28.7 arc(3.18,28.72) 3.12,28.76 1.96,29.91 arc(1.92,29.98) 1.91,30.06 v1(1.91,31.23)
$LED1_2: length 2.6
  Top Layer w0.127: LED1.2 0.99,32.46 0.46,31.93 0.46,30.53 0.64,30.35
$LED1_3: length 28.3
  Top Layer w0.102: v1(19.18,25.15) 20.11,25.15 arc(20.19,25.13) 20.25,25.09 21.28,24.05 arc(21.33,23.99) 21.34,23.91 R81.2
  Top Layer w0.127: v1(1.91,33.47) LED1.3
  Bottom Layer w0.127: 19.05,25.15 19.12,25.21 arc(19.16,25.28) 19.18,25.36 19.18,25.44 arc(19.16,25.52) 19.12,25.59 18.35,26.36 arc(18.28,26.4) 18.2,26.42 15.71,26.42 arc(15.63,26.43) 15.56,26.48 13.78,28.26 arc(13.71,28.31) 13.63,28.32 3,28.32 arc(2.93,28.34) 2.86,28.38 1.46,29.79 arc(1.41,29.85) 1.4,29.93 1.4,32.88 arc(1.41,32.96) 1.46,33.02 v1(1.91,33.47)
$LED1_4: length 30
  Top Layer w0.102: v1(18.7,24.64) 20.24,24.64 arc(20.31,24.62) 20.38,24.58 20.64,24.32 arc(20.69,24.25) 20.7,24.17 20.7,23.83 arc(20.69,23.76) 20.64,23.69 20.39,23.44 arc(20.34,23.37) 20.33,23.29 R80.2
  Top Layer w0.127: v1(1.91,34.55) LED1.4
  Bottom Layer w0.127: v1(18.7,24.64) 18.7,25.28 arc(18.69,25.36) 18.65,25.42 18.09,25.98 arc(18.03,26.02) 17.95,26.03 15.45,26.03 arc(15.37,26.05) 15.31,26.09 13.52,27.88 arc(13.46,27.92) 13.38,27.94 2.75,27.94 arc(2.67,27.96) 2.61,28 0.95,29.66 arc(0.9,29.72) 0.89,29.8 0.89,33.45 arc(0.9,33.53) 0.95,33.6 v1(1.91,34.55)
$OLED2_12: length 2.2
  Top Layer w0.254: OLED2.12 42.54,24.63 R67.2
$R2_1: length 0.8
  Top Layer w0.102: R2.1 44.2,12.32 44.88,12.32
  vias: v1(44.75,12.32)
$R3_1: length 0.6
  Top Layer w0.102: R3.1 44.56,13.33 44.58,13.32 v1(44.75,13.32)
$R4_2: length 1.5
  Top Layer w0.102: USB3.A5 7.6,8.87 arc(7.68,8.89) 7.75,8.93 7.78,8.96 arc(7.84,9) 7.92,9.02 R4.2
$R5_1: length 1.6
  Top Layer w0.102: R5.1 7.92,6.22 arc(7.84,6.21) 7.78,6.16 7.54,5.93 arc(7.48,5.89) 7.4,5.87 USB3.B5
$R39_1: length 3.6
  Top Layer w0.127: v1(11.68,12.95) 12.09,12.55 R39.1 ; v1(11.38,10.92) U24.7
  Bottom Layer w0.127: v1(11.68,12.95) 11.44,12.71 arc(11.4,12.65) 11.38,12.57 v1(11.38,10.92)
$R61_2: length 1.6
  Top Layer w0.102: U34.1 47.12,24.38 48.26,24.38 48.39,24.51
$R64_1: length 24.6
  Top Layer w0.102: v1(36.58,6.86) 36.58,13.84 arc(36.59,13.92) 36.64,13.99 36.64,13.99 arc(36.69,14.06) 36.7,14.14 R64.1
  Bottom Layer w0.102: U3.24 41.22,3.55 arc(41.24,3.63) 41.28,3.69 42.1,4.51 arc(42.15,4.58) 42.16,4.66 42.16,5.89 arc(42.15,5.96) 42.1,6.03 39.77,8.37 arc(39.7,8.41) 39.62,8.43 35.18,8.43 arc(35.1,8.41) 35.04,8.37 33.97,7.3 arc(33.92,7.23) 33.91,7.16 33.91,6.69 arc(33.92,6.61) 33.97,6.54 34.1,6.41 arc(34.17,6.37) 34.25,6.35 35.98,6.35 arc(36.06,6.37) 36.13,6.41 v1(36.58,6.86)
$R65_2: length 1.3
  Top Layer w0.508: U2.2 43.42,3.57 R65.2
$R66_1: length 4.5
  Top Layer w0.508: U35.1 51.18,3.55 R66.1
$R77_2: length 1.4
  Top Layer w0.102: U39.1 14.49,17.51 14.22,17.78 R77.2
$R83_2: length 2.4
  Top Layer w0.381: R83.2 29.87,18.8 U40.1
AP_32K_OUT: length 10.1
  Top Layer w0.102: U2.24 28.51,10.77 arc(28.43,10.76) 28.37,10.71 27.28,9.63 arc(27.24,9.56) 27.22,9.49 v1(27.22,6.35)
  Bottom Layer w0.102: U3.38 v1(27.22,6.35)
AP_WAKE_BT: length 30.6
  Top Layer w0.102: v1(42.93,7.17) U2.6
  Bottom Layer w0.102: v1(42.93,7.17) 42.93,8.81 arc(42.91,8.88) 42.87,8.95 40.42,11.39 arc(40.36,11.44) 40.28,11.45 26.14,11.45 arc(26.06,11.44) 26,11.39 22.28,7.68 arc(22.24,7.61) 22.22,7.53 U3.43
BT_REG_ON: length 28.5
  Top Layer w0.102: U2.34 v1(31.63,11.05) 31.63,11.34 arc(31.61,11.42) 31.57,11.48 30.54,12.51 arc(30.5,12.58) 30.48,12.66 R74.2
  Bottom Layer w0.102: U3.42 23.22,7.39 arc(23.24,7.47) 23.28,7.54 26.74,10.99 arc(26.8,11.03) 26.88,11.05 v1(31.63,11.05)
BT_UART_CTS: length 14.7
  Top Layer w0.102: U2.41 v1(37.93,5.21)
  Bottom Layer w0.102: v1(37.93,5.21) 30.06,5.21 arc(29.98,5.19) 29.91,5.15 29.28,4.52 arc(29.24,4.45) 29.22,4.38 U3.36
BT_UART_RTS: length 18.8
  Top Layer w0.102: U2.44 v1(40.63,5.21)
  Bottom Layer w0.102: U3.37 28.22,4.52 arc(28.24,4.6) 28.28,4.66 29.17,5.55 arc(29.24,5.6) 29.32,5.61 40.14,5.61 arc(40.22,5.6) 40.28,5.55 v1(40.63,5.21)
BT_UART_RX: length 14.5
  Top Layer w0.102: U2.42 v1(38.83,5.21)
  Bottom Layer w0.102: U3.35 30.22,4.11 arc(30.24,4.18) 30.28,4.25 30.78,4.74 arc(30.84,4.79) 30.92,4.8 38.34,4.8 arc(38.42,4.82) 38.48,4.86 v1(38.83,5.21)
BT_UART_TX: length 14.2
  Top Layer w0.102: U2.43 v1(39.73,5.21)
  Bottom Layer w0.102: U3.34 31.22,3.83 arc(31.24,3.91) 31.28,3.98 31.69,4.39 arc(31.76,4.43) 31.83,4.44 38.88,4.44 arc(38.96,4.46) 39.03,4.5 v1(39.73,5.21)
BT_WAKE_AP: length 23
  Top Layer w0.102: 42.13,8.1 U2.7 v1(41.35,8.07)
  Bottom Layer w0.102: U3.40 25.22,6.6 arc(25.24,6.68) 25.28,6.74 28.26,9.72 arc(28.33,9.76) 28.41,9.78 39.92,9.78 arc(40,9.76) 40.06,9.72 41.29,8.49 arc(41.34,8.42) 41.35,8.35 v1(41.35,8.07)
FB: length 2.4
  Top Layer w0.127: U24.6 12.09,10.22 R38.2 12.07,11.56 R37.1
FEL: length 43.4
  Top Layer w0.102: SW2.2 14.35,21.93 arc(14.37,21.85) 14.41,21.78 14.55,21.65 arc(14.61,21.61) 14.69,21.59 C87.1 16.07,21.27 arc(16.14,21.22) 16.21,21.21 22.4,21.21 arc(22.47,21.19) 22.54,21.15 24.45,19.24 arc(24.52,19.19) 24.59,19.18 33.06,19.18 arc(33.14,19.16) 33.21,19.12 34.23,18.09 arc(34.27,18.03) 34.29,17.95 34.29,16.59 arc(34.31,16.52) 34.35,16.45 34.48,16.32 arc(34.55,16.27) 34.63,16.26 34.84,16.26 arc(34.92,16.27) 34.98,16.32 35.37,16.7 arc(35.42,16.77) 35.43,16.85 35.43,22.78 arc(35.45,22.85) 35.49,22.92 36.39,23.82 arc(36.46,23.86) 36.53,23.88 v1(38.74,23.88)
  Bottom Layer w0.102: U3.7 44.56,20.32 arc(44.48,20.33) 44.42,20.38 43.37,21.43 arc(43.32,21.49) 43.31,21.57 43.31,23.03 arc(43.29,23.11) 43.25,23.17 42.35,24.07 arc(42.28,24.11) 42.21,24.13 39.07,24.13 arc(39,24.11) 38.93,24.07 v1(38.74,23.88)
HD_CEC: length 6.9
  Top Layer w0.102: 48.51,26.8 48.51,26.8 48.85,26.46 arc(48.88,26.41) 48.9,26.35 48.9,25.59 arc(48.88,25.53) 48.85,25.48 48.56,25.19 arc(48.51,25.16) 48.45,25.15 R61.1 ; 48.51,26.8 R60.1 ; 48.51,26.8 48.51,27.11 arc(48.52,27.17) 48.55,27.22 48.6,27.27 arc(48.64,27.32) 48.65,27.38 D5.2 D5.9 48.65,29.01 arc(48.64,29.07) 48.6,29.12 48.43,29.29 arc(48.38,29.33) 48.32,29.34 47.81,29.34 arc(47.76,29.35) 47.71,29.38 47.15,29.94 arc(47.11,29.99) 47.1,30.05 USB5.15
HD_CK+: length 18.8
  Top Layer w0.102: 47.1,29.34 D4.6 D4.5 47.1,27.13 47.23,27 ; USB5.12 46.5,32.4 arc(46.52,32.48) 46.56,32.55 46.62,32.6 arc(46.66,32.67) 46.68,32.75 46.68,33.02
  Bottom Layer w0.102: U3.96 38.22,28.52 arc(38.24,28.6) 38.28,28.67 39.53,29.91 arc(39.6,29.96) 39.67,29.97 42.84,29.97 arc(42.92,29.96) 42.99,29.91 43.76,29.14 arc(43.8,29.08) 43.81,29 43.81,28.79 arc(43.83,28.71) 43.87,28.64 44.19,28.33 arc(44.25,28.29) 44.33,28.27 45.75,28.27 arc(45.82,28.26) 45.89,28.21 v1(47.1,27) ; 47.1,29.34 47.2,29.44 47.2,31.91 arc(47.19,31.98) 47.14,32.05 46.74,32.45 arc(46.69,32.52) 46.68,32.6 46.68,33.02
  vias: v1(46.68,33.02) v1(47.1,29.33)
HD_CK-: length 21
  Top Layer w0.102: v1(47.26,32.89) 47.24,32.89 46.96,32.61 arc(46.92,32.54) 46.9,32.47 USB5.14 ; v1(47.73,27.01) 48.15,27.43 D5.1 D5.10 48.15,28.83 47.57,28.83 v1(47.62,28.88)
  Bottom Layer w0.102: v1(47.62,28.88) 47.62,32.07 arc(47.61,32.15) 47.56,32.21 47.32,32.45 arc(47.28,32.52) 47.26,32.59 v1(47.26,32.89) ; U3.95 37.22,28.5 arc(37.24,28.58) 37.28,28.65 37.66,29.02 arc(37.72,29.06) 37.8,29.08 38.01,29.08 arc(38.09,29.1) 38.16,29.14 39.18,30.17 arc(39.25,30.21) 39.33,30.23 42.97,30.23 arc(43.05,30.21) 43.11,30.17 44.01,29.27 arc(44.05,29.2) 44.07,29.13 44.07,28.9 arc(44.08,28.82) 44.13,28.76 44.35,28.53 arc(44.42,28.49) 44.5,28.47 46.17,28.47 arc(46.25,28.46) 46.32,28.42 v1(47.73,27.01)
HD_D0+: length 11
  Top Layer w0.102: USB5.9 45.9,29.65 arc(45.89,29.59) 45.86,29.55 45.65,29.33 arc(45.61,29.29) 45.6,29.23 D4.9 D4.2 45.6,27.13 v1(45.73,27)
  Bottom Layer w0.102: v1(45.73,27) 44.92,27.8 arc(44.86,27.85) 44.78,27.86 44.07,27.86 arc(43.99,27.88) 43.93,27.92 43.37,28.48 arc(43.32,28.55) 43.31,28.62 43.31,28.75 arc(43.29,28.82) 43.25,28.89 42.73,29.4 arc(42.67,29.45) 42.59,29.46 41.1,29.46 arc(41.03,29.45) 40.96,29.4 40.28,28.73 arc(40.24,28.66) 40.22,28.58 U3.98
HD_D0-: length 12.9
  Top Layer w0.102: 46.6,27 D4.4 D4.7 46.6,29.22 arc(46.59,29.28) 46.56,29.33 46.35,29.54 arc(46.31,29.59) 46.3,29.65 USB5.11
  Bottom Layer w0.102: v1(46.47,27) 45.47,28.01 arc(45.4,28.05) 45.32,28.07 44.15,28.07 arc(44.08,28.08) 44.01,28.13 43.62,28.52 arc(43.58,28.58) 43.56,28.66 43.56,28.87 arc(43.55,28.95) 43.5,29.02 42.86,29.66 arc(42.79,29.7) 42.72,29.72 40.42,29.72 arc(40.34,29.7) 40.28,29.66 39.28,28.67 arc(39.24,28.6) 39.22,28.52 U3.97
HD_D1+: length 10.4
  Top Layer w0.102: v1(44.58,28.88) 44.05,28.88 D3.6 D3.5 44.05,27.12 v1(44.17,27) ; v1(44.96,32.89) 45.24,32.61 arc(45.29,32.54) 45.3,32.47 USB5.6
  Bottom Layer w0.102: U3.100 42.75,28.33 arc(42.83,28.32) 42.9,28.27 v1(44.17,27) ; v1(44.96,32.89) 44.96,32.6 arc(44.94,32.52) 44.9,32.45 44.64,32.19 arc(44.6,32.13) 44.58,32.05 v1(44.58,28.88)
HD_D1-: length 13.1
  Top Layer w0.102: v1(45.54,33.02) 45.54,32.76 arc(45.55,32.68) 45.6,32.62 45.66,32.55 arc(45.7,32.49) 45.72,32.41 45.72,31.75 USB5.8 ; v1(44.97,27) 45.1,27.13 D4.1 D4.10 v1(45.1,29.34)
  Bottom Layer w0.102: v1(44.97,27) 44.37,27.6 arc(44.31,27.64) 44.23,27.66 43.93,27.66 arc(43.85,27.67) 43.78,27.72 43.11,28.39 arc(43.07,28.45) 43.05,28.53 43.05,28.62 arc(43.04,28.7) 42.99,28.76 42.6,29.15 arc(42.54,29.19) 42.46,29.21 41.74,29.21 arc(41.66,29.19) 41.6,29.15 41.28,28.84 arc(41.24,28.77) 41.22,28.69 U3.99 ; v1(45.1,29.34) 45,29.44 45,31.89 arc(45.01,31.97) 45.06,32.03 45.48,32.45 arc(45.52,32.52) 45.54,32.6 v1(45.54,33.02)
HD_D2+: length 8.1
  Top Layer w0.102: USB5.3 44.7,30.16 arc(44.69,30.1) 44.66,30.05 44.24,29.64 arc(44.19,29.6) 44.13,29.59 42.86,29.59 arc(42.8,29.58) 42.75,29.55 42.6,29.39 arc(42.56,29.34) 42.55,29.28 D3.9 D3.2 42.55,26.88 v1(42.8,26.64)
  Bottom Layer w0.102: v1(42.8,26.64) 44.06,25.38 arc(44.12,25.33) 44.2,25.32 U3.2
HD_D2-: length 6.2
  Top Layer w0.102: USB5.5 45.1,30.05 arc(45.09,29.99) 45.06,29.94 44.49,29.38 arc(44.45,29.35) 44.39,29.34 43.88,29.34 arc(43.82,29.33) 43.77,29.29 43.6,29.12 arc(43.56,29.07) 43.55,29.01 D3.7 D3.4 43.55,26.95 43.47,26.87
  Bottom Layer w0.102: 43.47,26.87 43.96,26.38 arc(44.03,26.33) 44.11,26.32 U3.1
  vias: v1(43.59,26.9)
HD_HPD: length 5.4
  Top Layer w0.102: USB5.1 44.3,30.25 arc(44.29,30.19) 44.26,30.14 44,29.89 arc(43.95,29.86) 43.9,29.84 42.61,29.84 arc(42.55,29.83) 42.5,29.8 42.1,29.4 arc(42.06,29.35) 42.05,29.29 D3.10 D3.1 42.05,26.81
HD_SCL: length 7.4
  Top Layer w0.102: USB5.17 47.5,30.16 arc(47.51,30.1) 47.55,30.05 47.96,29.64 arc(48.01,29.6) 48.07,29.59 49.34,29.59 arc(49.4,29.58) 49.45,29.55 49.6,29.39 arc(49.64,29.34) 49.65,29.28 D5.7 D5.4 49.65,27.45 49.28,27.09 arc(49.25,27.04) 49.24,26.98 49.24,26.45 arc(49.25,26.39) 49.28,26.34 49.66,25.97 R57.1 49.66,25.27 R56.1
HD_SDA: length 8.5
  Top Layer w0.102: USB5.18 47.7,31.61 arc(47.71,31.55) 47.75,31.5 48.21,31.04 arc(48.24,30.99) 48.25,30.93 48.25,30.68 arc(48.26,30.62) 48.3,30.57 48.98,29.89 arc(49.03,29.86) 49.09,29.84 49.59,29.84 arc(49.65,29.83) 49.7,29.8 50.1,29.4 arc(50.14,29.35) 50.15,29.29 D5.6 D5.5 50.15,27.37 49.66,26.87 R59.1 49.66,26.71 49.99,26.37 arc(50.03,26.32) 50.04,26.26 50.04,25.63 arc(50.05,25.57) 50.08,25.52 50.46,25.15 R58.1
HDMI_5V: length 8.2
  Top Layer w0.203: USB5.19 47.9,30.2 48.11,30 v1(48.3,30)
  Top Layer w0.254: U33.1 R57.2 R59.2 50.42,27.18 50.67,27.43 v1(50.67,29.08)
  Bottom Layer w0.254: v1(48.3,30) 49.76,30 v1(50.67,29.08)
HDMI_CEC: length 14.1
  Top Layer w0.102: v1(47.88,26.03) R60.2
  Bottom Layer w0.102: v1(47.88,26.03) 46.74,24.9 arc(46.68,24.86) 46.6,24.84 43.06,24.84 arc(42.98,24.86) 42.92,24.9 40.83,26.99 arc(40.76,27.04) 40.68,27.05 37.07,27.05 arc(36.99,27.07) 36.92,27.11 36.28,27.75 arc(36.24,27.81) 36.22,27.89 36.22,28.08
HDMI_HPD: length 10
  Top Layer w0.102: v1(40.25,26.05) R55.2
  Bottom Layer w0.102: v1(40.25,26.05) 35.25,26.05 arc(35.17,26.07) 35.1,26.11 33.28,27.93 arc(33.24,28) 33.22,28.07 U3.91
HDMI_SCL: length 16.8
  Top Layer w0.102: v1(49.53,23.88) R56.2
  Bottom Layer w0.102: 35.22,28.21 35.22,28.02 arc(35.24,27.94) 35.28,27.88 36.3,26.86 arc(36.37,26.81) 36.45,26.8 40.43,26.8 arc(40.51,26.78) 40.57,26.74 43.42,23.89 arc(43.48,23.85) 43.56,23.83 49.49,23.83 v1(49.53,23.88)
HDMI_SDA: length 19.7
  Top Layer w0.102: v1(50.55,23.88) R58.2
  Bottom Layer w0.102: U3.92 34.22,28.15 arc(34.24,28.07) 34.28,28 35.68,26.6 arc(35.75,26.56) 35.83,26.54 40.3,26.54 arc(40.38,26.53) 40.45,26.48 44.03,22.9 arc(44.1,22.85) 44.18,22.84 49.42,22.84 arc(49.5,22.85) 49.57,22.9 v1(50.55,23.88)
I2S_BCK: length 24
  Top Layer w0.102: v1(23.76,10.35) 23.89,10.22 arc(23.95,10.18) 24.03,10.16 26.84,10.16 arc(26.92,10.18) 26.98,10.22 28.26,11.5 arc(28.31,11.56) 28.32,11.64 28.32,14.78 arc(28.34,14.85) 28.38,14.92 29.86,16.39 30.87,16.39 31.87,17.39 U40.5
  Bottom Layer w0.102: 23.75,10.29 23.68,10.35 arc(23.62,10.4) 23.54,10.41 22.44,10.41 arc(22.36,10.4) 22.29,10.35 21.01,9.08 arc(20.97,9.01) 20.96,8.93 20.96,4.02 arc(20.94,3.94) 20.9,3.88 20.28,3.27 arc(20.24,3.2) 20.22,3.12 U3.45
I2S_DI: length 24.9
  Top Layer w0.102: U40.3 30.87,17.4 30.35,16.89 29.34,16.89 27.87,15.43 arc(27.83,15.36) 27.81,15.28 27.81,11.89 arc(27.8,11.82) 27.75,11.75 26.98,10.98 arc(26.92,10.94) 26.84,10.92 v1(24.89,10.92)
  Bottom Layer w0.102: v1(24.89,10.92) 24.8,11.01 arc(24.74,11.06) 24.66,11.07 22.33,11.07 arc(22.25,11.06) 22.19,11.01 20.51,9.33 arc(20.46,9.26) 20.45,9.19 20.45,4.53 arc(20.43,4.45) 20.39,4.39 20,4 arc(19.93,3.95) 19.85,3.94 19.01,3.94 arc(18.93,3.92) 18.86,3.88 18.28,3.3 arc(18.24,3.23) 18.22,3.15 U3.47
I2S_DO: length 25.4
  Top Layer w0.102: v1(25.27,11.44) 26.98,11.44 arc(27.06,11.46) 27.13,11.5 27.5,11.88 arc(27.54,11.94) 27.56,12.02 27.56,15.54 arc(27.57,15.61) 27.62,15.68 29.08,17.14 30.1,17.14 30.35,17.4 30.35,18.42 U40.2
  Bottom Layer w0.102: 25.4,11.44 22.32,11.44 arc(22.25,11.43) 22.18,11.39 20.25,9.46 arc(20.21,9.39) 20.19,9.31 20.19,4.66 arc(20.18,4.58) 20.13,4.51 19.85,4.23 arc(19.78,4.18) 19.71,4.17 18.35,4.17 arc(18.27,4.15) 18.21,4.11 17.28,3.19 arc(17.24,3.12) 17.22,3.04 U3.48
I2S_LRCK: length 24.4
  Top Layer w0.102: U40.4 31.37,17.39 30.61,16.64 29.59,16.64 28.13,15.17 arc(28.08,15.11) 28.07,15.03 28.07,11.77 arc(28.05,11.69) 28.01,11.62 26.96,10.58 arc(26.89,10.53) 26.82,10.52 24.49,10.52 arc(24.41,10.53) 24.35,10.58 v1(24.26,10.67)
  Bottom Layer w0.102: v1(24.26,10.67) 24.16,10.77 22.41,10.77 arc(22.33,10.75) 22.27,10.71 20.76,9.2 arc(20.72,9.14) 20.7,9.06 20.7,4.4 arc(20.69,4.32) 20.64,4.26 20.13,3.74 arc(20.06,3.7) 19.98,3.68 19.77,3.68 arc(19.69,3.67) 19.63,3.62 19.28,3.28 arc(19.24,3.22) 19.22,3.14 U3.46
I2S_MCK: length 23.9
  Top Layer w0.102: U40.6 32.37,17.38 31.12,16.13 30.04,16.13 28.63,14.73 arc(28.59,14.66) 28.57,14.58 28.57,11.51 arc(28.56,11.44) 28.52,11.37 26.93,9.78 arc(26.86,9.74) 26.78,9.72 v1(23.76,9.72)
  Bottom Layer w0.102: U3.44 21.22,8.82 arc(21.24,8.9) 21.28,8.96 22.29,9.97 arc(22.36,10.02) 22.44,10.03 23.28,10.03 arc(23.36,10.02) 23.43,9.97 23.75,9.65
LED_B: length 28.4
  Top Layer w0.102: R82.1 24.34,22.06 arc(24.41,22.05) 24.48,22 25.85,20.63 arc(25.89,20.57) 25.91,20.49 v1(25.91,19.81)
  Bottom Layer w0.102: U3.53 13.08,7.32 arc(13.15,7.33) 13.22,7.38 13.66,7.81 arc(13.7,7.88) 13.72,7.96 13.72,9.31 arc(13.73,9.39) 13.78,9.46 14.4,10.08 arc(14.44,10.14) 14.46,10.22 14.46,15.01 arc(14.47,15.08) 14.51,15.15 14.57,15.2 arc(14.63,15.25) 14.71,15.26 17.18,15.26 17.18,15.27 19.5,15.27 arc(19.58,15.28) 19.64,15.33 20.45,16.14 arc(20.5,16.2) 20.51,16.28 20.51,18.52 arc(20.53,18.6) 20.57,18.66 20.9,18.99 arc(20.97,19.03) 21.05,19.05 25.06,19.05 arc(25.14,19.07) 25.21,19.11 v1(25.91,19.81)
LED_G: length 27.3
  Top Layer w0.102: v1(25.27,19.81) 25.27,20.49 arc(25.26,20.57) 25.21,20.63 24.19,21.66 arc(24.12,21.7) 24.05,21.72 21.77,21.72 arc(21.69,21.73) 21.63,21.78 R81.1
  Bottom Layer w0.102: U3.54 12.93,8.32 arc(13.01,8.33) 13.08,8.38 13.4,8.7 arc(13.45,8.77) 13.46,8.85 13.46,9.35 arc(13.48,9.43) 13.52,9.49 14.16,10.13 arc(14.21,10.2) 14.22,10.28 14.22,15.16 arc(14.24,15.23) 14.28,15.3 14.42,15.43 arc(14.48,15.48) 14.56,15.49 19.38,15.49 arc(19.46,15.51) 19.52,15.55 20.25,16.28 arc(20.29,16.35) 20.31,16.42 20.31,18.7 arc(20.33,18.78) 20.37,18.84 20.77,19.24 arc(20.83,19.29) 20.91,19.3 24.68,19.3 arc(24.76,19.32) 24.82,19.36 v1(25.27,19.81)
LED_R: length 26.3
  Top Layer w0.102: R80.1 20.87,21.52 arc(20.93,21.48) 21.01,21.46 23.66,21.46 arc(23.74,21.45) 23.81,21.4 24.58,20.63 arc(24.62,20.57) 24.64,20.49 v1(24.64,19.81)
  Bottom Layer w0.102: U3.55 12.92,9.32 arc(12.99,9.33) 13.06,9.38 13.91,10.23 arc(13.95,10.29) 13.97,10.37 13.97,15.28 arc(13.99,15.36) 14.03,15.43 14.29,15.69 arc(14.36,15.73) 14.44,15.75 19.27,15.75 arc(19.35,15.76) 19.42,15.81 20.01,16.4 arc(20.05,16.46) 20.07,16.54 20.07,18.84 arc(20.08,18.92) 20.13,18.98 20.64,19.5 arc(20.71,19.54) 20.78,19.56 24.3,19.56 arc(24.38,19.57) 24.44,19.62 v1(24.64,19.81)
OLED_RST: length 4.8
  Top Layer w0.254: OLED2.9 44.08,22.78 U41.2 46.86,22.73 C91.2 R84.1
OLED_SCL: length 83.1
  Top Layer w0.102: OLED2.10 44.04,23.37 42.38,23.37 arc(42.3,23.35) 42.23,23.31 42.1,23.17 arc(42.05,23.11) 42.04,23.03 v1(42.04,22.73) 42.01,22.71 39.99,22.71 arc(39.91,22.73) 39.84,22.77 v1(39.75,22.86) ; v1(16.49,17.05) 16.26,17.29 U39.13 ; R79.2 12.26,1.2 arc(12.32,1.16) 12.4,1.14 13,1.14 arc(13.07,1.13) 13.14,1.08 13.16,1.07 arc(13.22,1.02) 13.3,1.01 14.89,1.01 arc(14.97,1.02) 15.04,1.07 15.66,1.69 arc(15.7,1.75) 15.72,1.83 v1(15.72,4.61)
  Bottom Layer w0.102: v1(16.49,17.05) 16.49,18.25 arc(16.51,18.33) 16.55,18.39 18.54,20.39 arc(18.61,20.43) 18.69,20.45 36.75,20.45 arc(36.82,20.46) 36.89,20.51 39.18,22.8 arc(39.25,22.84) 39.33,22.86 v1(39.75,22.86) ; v1(42.04,22.73) 41.08,21.78 arc(41.04,21.71) 41.02,21.63 41.02,14.94 arc(41.01,14.87) 40.96,14.8 39.56,13.39 arc(39.49,13.35) 39.41,13.33 18.75,13.33 arc(18.68,13.32) 18.61,13.28 18.22,12.89 arc(18.15,12.84) 18.08,12.83 16.85,12.83 arc(16.77,12.81) 16.7,12.77 16.44,12.51 arc(16.4,12.44) 16.38,12.36 16.38,9.74 arc(16.37,9.66) 16.32,9.59 15.78,9.04 arc(15.73,8.98) 15.72,8.9 v1(15.72,4.61) 15.72,4.22 16.22,3.72 U3.49
OLED_SDA: length 83.8
  Top Layer w0.102: v1(15.22,5.87) 14.74,5.39 arc(14.7,5.32) 14.68,5.25 14.68,1.43 arc(14.66,1.35) 14.62,1.29 14.61,1.27 arc(14.54,1.23) 14.46,1.21 13.39,1.21 arc(13.31,1.23) 13.24,1.27 12.99,1.52 R78.2 ; OLED2.11 42.89,24.01 arc(42.82,24) 42.75,23.95 42.48,23.68 arc(42.41,23.64) 42.33,23.62 41.94,23.62 arc(41.86,23.61) 41.79,23.56 41.4,23.17 v1(41.4,23.11) 40.6,23.11 arc(40.52,23.13) 40.45,23.17 v1(40,23.62) ; v1(15.82,17.05) 15.76,17.11 U39.14
  Bottom Layer w0.102: U3.50 v1(15.22,5.87) 15.22,8.79 arc(15.24,8.87) 15.28,8.93 16.07,9.72 arc(16.11,9.79) 16.13,9.86 16.13,12.49 arc(16.14,12.57) 16.19,12.63 16.58,13.02 arc(16.64,13.07) 16.72,13.08 17.95,13.08 arc(18.03,13.1) 18.09,13.14 18.48,13.53 arc(18.55,13.57) 18.63,13.59 39.29,13.59 arc(39.36,13.6) 39.43,13.65 40.71,14.93 arc(40.75,14.99) 40.77,15.07 40.77,22.39 arc(40.78,22.47) 40.83,22.54 v1(41.4,23.11) ; v1(15.82,17.05) 15.82,18.24 arc(15.84,18.31) 15.88,18.38 18.4,20.9 arc(18.46,20.94) 18.54,20.95 36.62,20.95 arc(36.7,20.97) 36.76,21.01 39.31,23.56 arc(39.38,23.61) 39.45,23.62 v1(40,23.62)
PI13: length 9.7
  Bottom Layer w0.102: U3.57 12.7,11.3 11.74,10.35 arc(11.68,10.3) 11.6,10.29 11.23,10.29 arc(11.15,10.3) 11.08,10.35 10.73,10.7 arc(10.68,10.77) 10.67,10.84 10.67,11.47 arc(10.68,11.55) 10.73,11.62 10.86,11.75 arc(10.91,11.82) 10.92,11.89 10.92,13.76 arc(10.91,13.84) 10.86,13.9 10.35,14.42 arc(10.3,14.48) 10.29,14.56 10.29,15.48 arc(10.27,15.55) 10.23,15.62 9.46,16.39 arc(9.41,16.45) 9.4,16.53 H7.1
PI14: length 12.9
  Bottom Layer w0.102: H8.1 9.5,19.63 arc(9.58,19.62) 9.65,19.57 10.48,18.74 arc(10.53,18.68) 10.54,18.6 10.54,14.7 arc(10.56,14.63) 10.6,14.56 11.09,14.08 arc(11.13,14.01) 11.15,13.93 11.15,11.71 arc(11.13,11.63) 11.09,11.57 10.96,11.44 arc(10.91,11.38) 10.9,11.3 10.9,10.9 arc(10.92,10.82) 10.96,10.76 11.14,10.58 arc(11.2,10.54) 11.28,10.52 11.47,10.52 arc(11.54,10.54) 11.61,10.58 11.75,10.72 arc(11.8,10.79) 11.81,10.86 11.81,11.62 arc(11.83,11.69) 11.87,11.76 12.37,12.26 arc(12.43,12.3) 12.51,12.32 U3.58
